# Altium schematic sheet SensorBoard.SchDoc: Sensor Board - MCU, Sensors, RS485
size A4; DocumentNumber: 1; Revision: 1; SheetNumber: 1; SheetTotal: 1
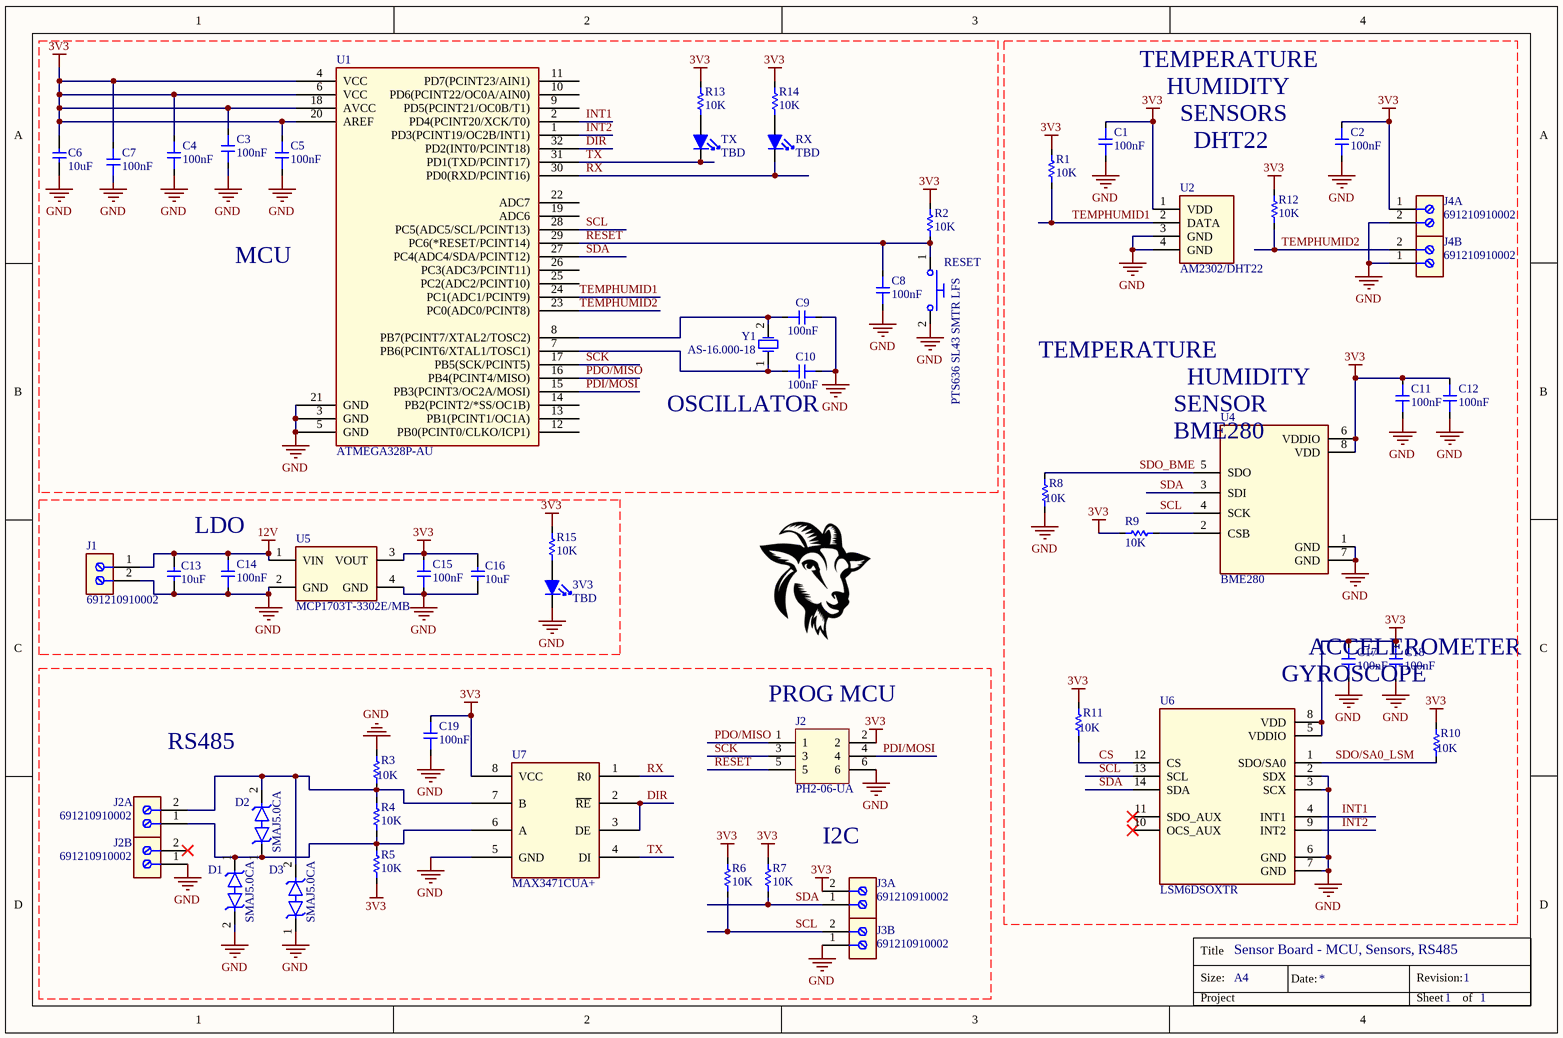
[diagram p0: SensorBoard.SchDoc]

## Parts
3V3  TBD  [CASE0603]
C1  100nF  [CASE0603]
C2  100nF  [CASE0603]
C3  100nF  [CASE0603]
C4  100nF  [CASE0603]
C5  100nF  [CASE0603]
C6  10uF  [CASE0603]
C7  100nF  [CASE0603]
C8  100nF  [CASE0603]
C9  100nF  [CASE0603]
C10  100nF  [CASE0603]
C11  100nF  [CASE0603]
C12  100nF  [CASE0603]
C13  10uF  [CASE0603]
C14  100nF  [CASE0603]
C15  100nF  [CASE0603]
C16  10uF  [CASE0603]
C17  100nF  [CASE0603]
C18  100nF  [CASE0603]
C19  100nF  [CASE0603]
D1  SMAJ5.0CA  [SMA]
D2  SMAJ5.0CA  [SMA]
D3  SMAJ5.0CA  [SMA]
J1  691210910002  [691210910002]
J2  PH2-06-UA  [Header_2x3_2.54_Male]
J2A  691210910002  [691210910002]
J2B  691210910002  [691210910002]
J3A  691210910002  [691210910002]
J3B  691210910002  [691210910002]
J4A  691210910002  [691210910002]
J4B  691210910002  [691210910002]
R1  10K  [CASE0603]
R2  10K  [CASE0603]
R3  10K  [CASE0603]
R4  10K  [CASE0603]
R5  10K  [CASE0603]
R6  10K  [CASE0603]
R7  10K  [CASE0603]
R8  10K  [CASE0603]
R9  10K  [CASE0603]
R10  10K  [CASE0603]
R11  10K  [CASE0603]
R12  10K  [CASE0603]
R13  10K  [CASE0603]
R14  10K  [CASE0603]
R15  10K  [CASE0603]
RESET  PTS636 SL43 SMTR LFS  [SMT Button]
RX  TBD  [CASE0603]
TX  TBD  [CASE0603]
U1  ATMEGA328P-AU  [TQFP-32]
U2  AM2302/DHT22  [AM2302_TEMP_HUMID_SENSOR]
U4  BME280  [VFLGA-8]
U5  MCP1703T-3302E/MB  [SOT-223-3]
U6  LSM6DSOXTR  [VFLGA-14]  (mechanical)
U7  MAX3471CUA+  [TSSOP-8]
Y1  AS-16.000-18  [HC-49/US]

## Nets
3V3: C1.1 C2.1 C3.2 C4.2 C5.2 C6.2 C7.2 C11.1 C12.1 C15.2 C16.2 C17.1 C18.1 C19.2 J2.2 J3A.2 J4A.1 R1.1 R2.1 R5.2 R6.1 R7.1 R9.1 R10.1 R11.1 R12.1 R13.1 R14.1 R15.1 U1.4(VCC) U1.6(VCC) U1.18(AVCC) U1.20(AREF) U2.1(VDD) U4.6(VDDIO) U4.8(VDD) U5.3(VOUT) U6.5(VDDIO) U6.8(VDD) U7.8(VCC)
12V: C13.2 C14.2 J1.1 U5.1(VIN)
GND: 3V3.2(K) C1.2 C2.2 C3.1 C4.1 C5.1 C6.1 C7.1 C8.2 C9.1 C10.1 C11.2 C12.2 C13.1 C14.1 C15.1 C16.1 C17.2 C18.2 C19.1 D1.2 D3.1 J1.2 J2.6 J2B.1 J3B.1 J4A.2 J4B.1 R3.1 R8.2 RESET.2 U1.3(GND) U1.5(GND) U1.21(GND) U2.3(GND) U2.4(GND) U4.1(GND) U4.7(GND) U5.2(GND) U5.4(GND) U6.2(SDX) U6.3(SCX) U6.6(GND) U6.7(GND) U7.5(GND)
CS: R11.2 U6.12(CS)
DIR: U1.32(PD2(INT0/PCINT18)) U7.2(~{RE}) U7.3(DE)
INT1: U1.2(PD4(PCINT20/XCK/T0)) U6.4(INT1)
INT2: U1.1(PD3(PCINT19/OC2B/INT1)) U6.9(INT2)
PDI/MOSI: J2.4 U1.15(PB3(PCINT3/OC2A/MOSI))
PDO/MISO: J2.1 U1.16(PB4(PCINT4/MISO))
~{RESET}: C8.1 J2.5 R2.2 RESET.1 U1.29(PC6(*RESET/PCINT14))
RX: RX.2(K) U1.30(PD0(RXD/PCINT16)) U7.1(R0)
SCK: J2.3 U1.17(PB5(SCK/PCINT5))
SCL: J3B.2 R6.2 U1.28(PC5(ADC5/SCL/PCINT13)) U4.4(SCK) U6.13(SCL)
SDA: J3A.1 R7.2 U1.27(PC4(ADC4/SDA/PCINT12)) U4.3(SDI) U6.14(SDA)
SDO/SA0_LSM: R10.2 U6.1(SDO/SA0)
SDO_BME: R8.1 U4.5(SDO)
TEMPHUMID1: R1.2 U1.24(PC1(ADC1/PCINT9)) U2.2(DATA)
TEMPHUMID2: J4B.2 R12.2 U1.23(PC0(ADC0/PCINT8))
TX: TX.2(K) U1.31(PD1(TXD/PCINT17)) U7.4(DI)
Net3V3_1: 3V3.1(A) R15.2
NetC9_2: C9.2 U1.8(PB7(PCINT7/XTAL2/TOSC2)) Y1.2(OSC2)
NetC10_2: C10.2 U1.7(PB6(PCINT6/XTAL1/TOSC1)) Y1.1(OSC1)
NetD1_1: D1.1 D2.1 J2A.1 R4.2 R5.1 U7.6(A)
NetD2_2: D2.2 D3.2 J2A.2 R3.2 R4.1 U7.7(B)
NetR9_2: R9.2 U4.2(CSB)
NetR13_2: R13.2 TX.1(A)
NetR14_2: R14.2 RX.1(A)

Not connected (* = marked no-connect by the designer): J2B 2*; U1 9(PD5(PCINT21/OC0B/T1)) 10(PD6(PCINT22/OC0A/AIN0)) 11(PD7(PCINT23/AIN1)) 12(PB0(PCINT0/CLKO/ICP1)) 13(PB1(PCINT1/OC1A)) 14(PB2(PCINT2/*SS/OC1B)) 19(ADC6) 22(ADC7) 25(PC2(ADC2/PCINT10)) 26(PC3(ADC3/PCINT11)); U6 10(OCS_AUX)* 11(SDO_AUX)*

## Notes on the sheet
- TEMPERATURE
- HUMIDITY
- SENSORS
- DHT22
- MCU
- (near C10) OSCILLATOR
- (near U4) SENSOR
- BME280
- LDO
- ACCELEROMETER
- (near J2) PROG MCU
- (near U6) GYROSCOPE
- RS485
- I2C
- Title
- Size:
- A4
- Date:
- Revision:
- Project
- Sheet
- of

## Library data of the parts
3V3 RX TX = LED: Typical INFRARED GaAs LED
C1-C5 C7-C12 C14 C15 C17-C19 = Capacitor_100nF: CAP CER 100nF 5% 25V X7R 0603; MFR: KEMET; MFR PN: C0603C104J3RAC; Supplier: Mouser; Supplier PN: 80-C0603C104J3RAC; Datasheet: https://eu.mouser.com/ProductDetail/KEMET/C0603C104J3RAC?qs=zlI8QACJnq%252BcGF637t1xBQ%3D%3D
C6 C13 C16 = Capacitor_10uF: CAP CER 10uF 20% 25V X5R 0603; MFR: TDK; MFR PN: C1608X5R1E106M080AC; Supplier: Mouser; Supplier PN: 810-C1608X5R1E106M; Datasheet: https://eu.mouser.com/ProductDetail/TDK/C1608X5R1E106M080AC?qs=dfay7wIA1uGdHfZTkqsICA%3D%3D
D1-D3 = Diode_SMAJ5.0CA: 9.2V Clamp 43.5A Ipp Tvs Diode Surface Mount DO-214AC (SMA); MFR: Good-Ark Semiconductor; Datasheet: https://www.digikey.ro/en/products/detail/good-ark-semiconductor/SMAJ5-0CA/18649098; MFR PN: SMAJ5.0CA; Supplier: Digi Key; Supplier PN: 4786-SMAJ5.0CACT-ND
J1 J2A J2B J3A J3B J4A J4B = Connector_691210910002: TERM BLOCK 2P HORIZON 2.54MM PCB; MFR: Wurth; Datasheet: https://www.digikey.ro/en/products/detail/w%C3%BCrth-elektronik/691210910002/10668428?s=N4IgTCBcDaIGwE4CMYkAZlqxAugXyA; MFR PN: 691210910002; Supplier PN: 732-691210910002-ND; Supplier: Digi Key
J2 = Connector_PH2-06-UA: Connector Header Through Hole 6 position 0.100" (2.54mm); MFR: Adam Tech; MFR PN: PH2-06-UA; Supplier: Digi Key; Supplier PN: 2057-PH2-06-UA-ND; Datasheet: https://www.digikey.ro/en/products/detail/adam-tech/PH2-06-UA/9830396
R1-R15 = Resistor_10K_0603: RES 10K 1% 1/10W 0603; MFR: YAGEO; MFR PN: RC0603FR-0710KL; Supplier: Mouser; Supplier PN: 603-RC0603FR-0710KL; Datasheet: https://eu.mouser.com/ProductDetail/YAGEO/RC0603FR-0710KL?qs=grNVn54RoB%252B3GtjbJj3wJQ%3D%3D
RESET = Button_PTS636 SL43 SMTR LFS: 9.2V Clamp 43.5A Ipp Tvs Diode Surface Mount DO-214AC (SMA); MFR: C&K; Datasheet: https://www.digikey.ro/en/products/detail/c-k/PTS636-SL43-SMTR-LFS/10071722; MFR PN: PTS636 SL43 SMTR LFS; Supplier: Digi Key; Supplier PN: CKN12309-1-ND
U1 = IC_ATMEGA328: AVR AVR® ATmega Microcontroller IC 8-Bit 20MHz 32KB (16K x 16) FLASH 32-TQFP (7x7); MFR PN: Microchip; MFR: ATMEGA328P-AU; Supplier: Digi Key; Supplier PN: ATMEGA328P-AU-ND; Datasheet: https://www.digikey.com/en/products/detail/microchip-technology/ATMEGA328P-AU/1832260
U2 = IC_AM2302/DHT22: DIGITAL HUMIDITY, PRESSURE AND TEMPERATURE SENSOR; Datasheet: N/A; MFR: N/A; MFR PN: AM2302/DHT22; Supplier: N/A; Supplier PN: AM2302/DHT22
U4 = IC_BME280: DIGITAL HUMIDITY, PRESSURE AND TEMPERATURE SENSOR; MFR: Bosch; Datasheet: https://www.digikey.ro/en/products/detail/bosch-sensortec/BME280/6136306; MFR PN: BME280; Supplier: Digi Key; Supplier PN: 828-1063-1-ND
U5 = MCP1703T-3302E/MB: IC REG LINEAR 3.3V 250MA SOT89-3; MFR: Microchip; MFR PN: MCP1703T-3302E/MB; Supplier: Digi Key; Supplier PN: MCP1703T-3302E/MBCT-ND; Datasheet: https://www.digikey.ro/en/products/detail/microchip-technology/MCP1703T-3302E-MB/1635604
U6 = IC_LSM6DSOXTR: Accelerometer, Gyroscope, 6 Axis Sensor I²C, SPI Output; MFR: STMicroelectronics; Supplier: Digi Key; Supplier PN: 497-18367-1-ND; Datasheet: https://www.digikey.gr/en/products/detail/stmicroelectronics/LSM6DSOXTR/9841882?s=N4IgTCBcDaIDIGUCyA2AIgg8gDQCoCUQBdAXyA; MFR PN: LSM6DSOXTR
U7 = IC_MAX3471: IC TRANSCEIVER HALF 1/1 8UMAX; MFR: Analog Devices; Datasheet: https://www.digikey.com/en/products/detail/analog-devices-inc-maxim-integrated/max3471cua/1702211; MFR PN: MAX3471CUA+; Supplier: Digi Key; Supplier PN: MAX3471CUA+-ND
Y1 = Crystal_AS-16.000-18: 16 MHz ±30ppm Crystal 18pF 40 Ohms HC-49/US; MFR: Raltron Electronics; MFR PN: AS-16.000-18; Datasheet: https://www.digikey.ro/en/products/detail/raltron-electronics/AS-16-000-18/10271769; Supplier PN: 2151-AS-16.000-18-ND; Supplier: Digi Key